# EAGLE design hello.slave (EAGLE 8.6.3)
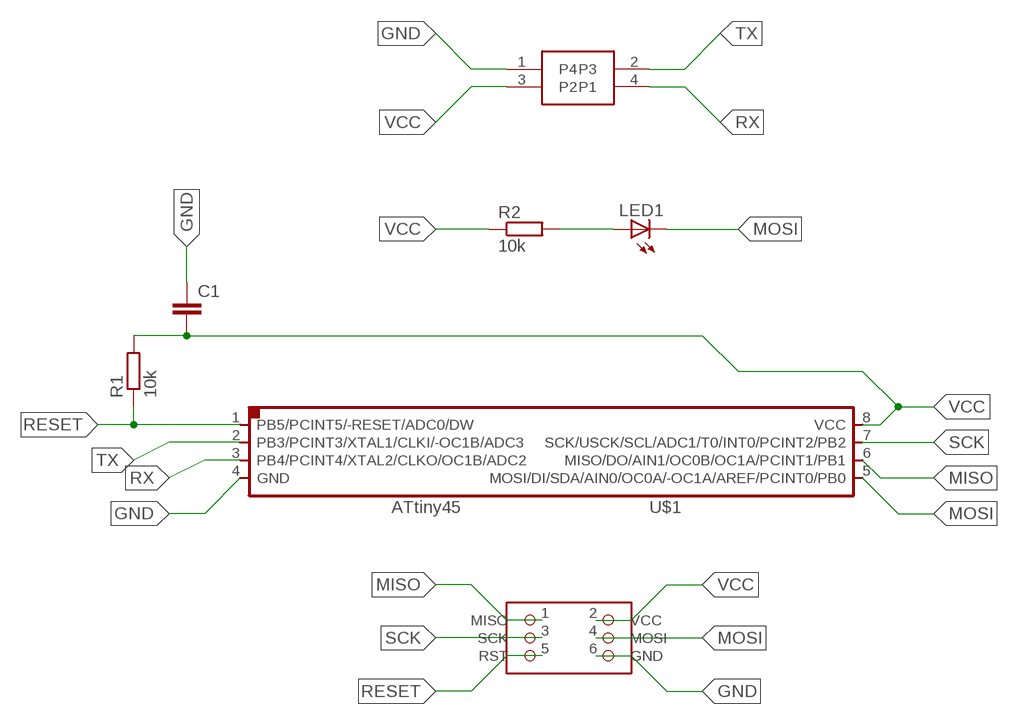
[diagram p0: schematic, sheet 1]

## Parts
C1  C  [C0805]
LED1  LED_E  [LED_1206]
R1  10k  R  [R0805]
R2  10k  R  [R0805]
U$1  ATTINY45SI  [SOIC8]
U$2  AVRISPSMD  [2X03SMD]
U$4  4PIN-SMD-CONNECTOR  [2X02SMD]

## Nets
GND: C1.1 U$1.4(GND) U$2.6(GND) U$4.1(P4)
MISO: U$1.6(MISO/DO/AIN1/OC0B/OC1A/PCINT1/PB1) U$2.1(MISO)
MOSI: LED1.C U$1.5(MOSI/DI/SDA/AIN0/OC0A/-OC1A/AREF/PCINT0/PB0) U$2.4(MOSI)
N$3: LED1.A R2.2
RESET: R1.1 U$1.1(PB5/PCINT5/-RESET/ADC0/DW) U$2.5(RST)
RX: U$1.3(PB4/PCINT4/XTAL2/CLKO/OC1B/ADC2) U$4.4(P1)
SCK: U$1.7(SCK/USCK/SCL/ADC1/T0/INT0/PCINT2/PB2) U$2.3(SCK)
TX: U$1.2(PB3/PCINT3/XTAL1/CLKI/-OC1B/ADC3) U$4.2(P3)
VCC: C1.2 R1.2 R2.1 U$1.8(VCC) U$2.2(VCC) U$4.3(P2)

## Library data of the parts
C1 = eagle-ltspice:C: CAPACITOR, European symbol; SPICEMODEL: NONE; SPICEPREFIX: C
LED1 = eagle-ltspice:LED_E: LED Source: http://www.osram.convergy.de Source: www.luxeon.com Source: www.kingbright.com; SPICEMODEL: NONE; SPICEPREFIX: D; SPICETYPE: diode
R1 R2 = eagle-ltspice:R: RESISTOR, European symbol; SPICEMODEL: NONE; SPICEPREFIX: R
U$1 = fab:ATTINY45
U$2 = fab:AVRISP
U$4 = fab:4PIN-SMD-CONNECTOR

## Board
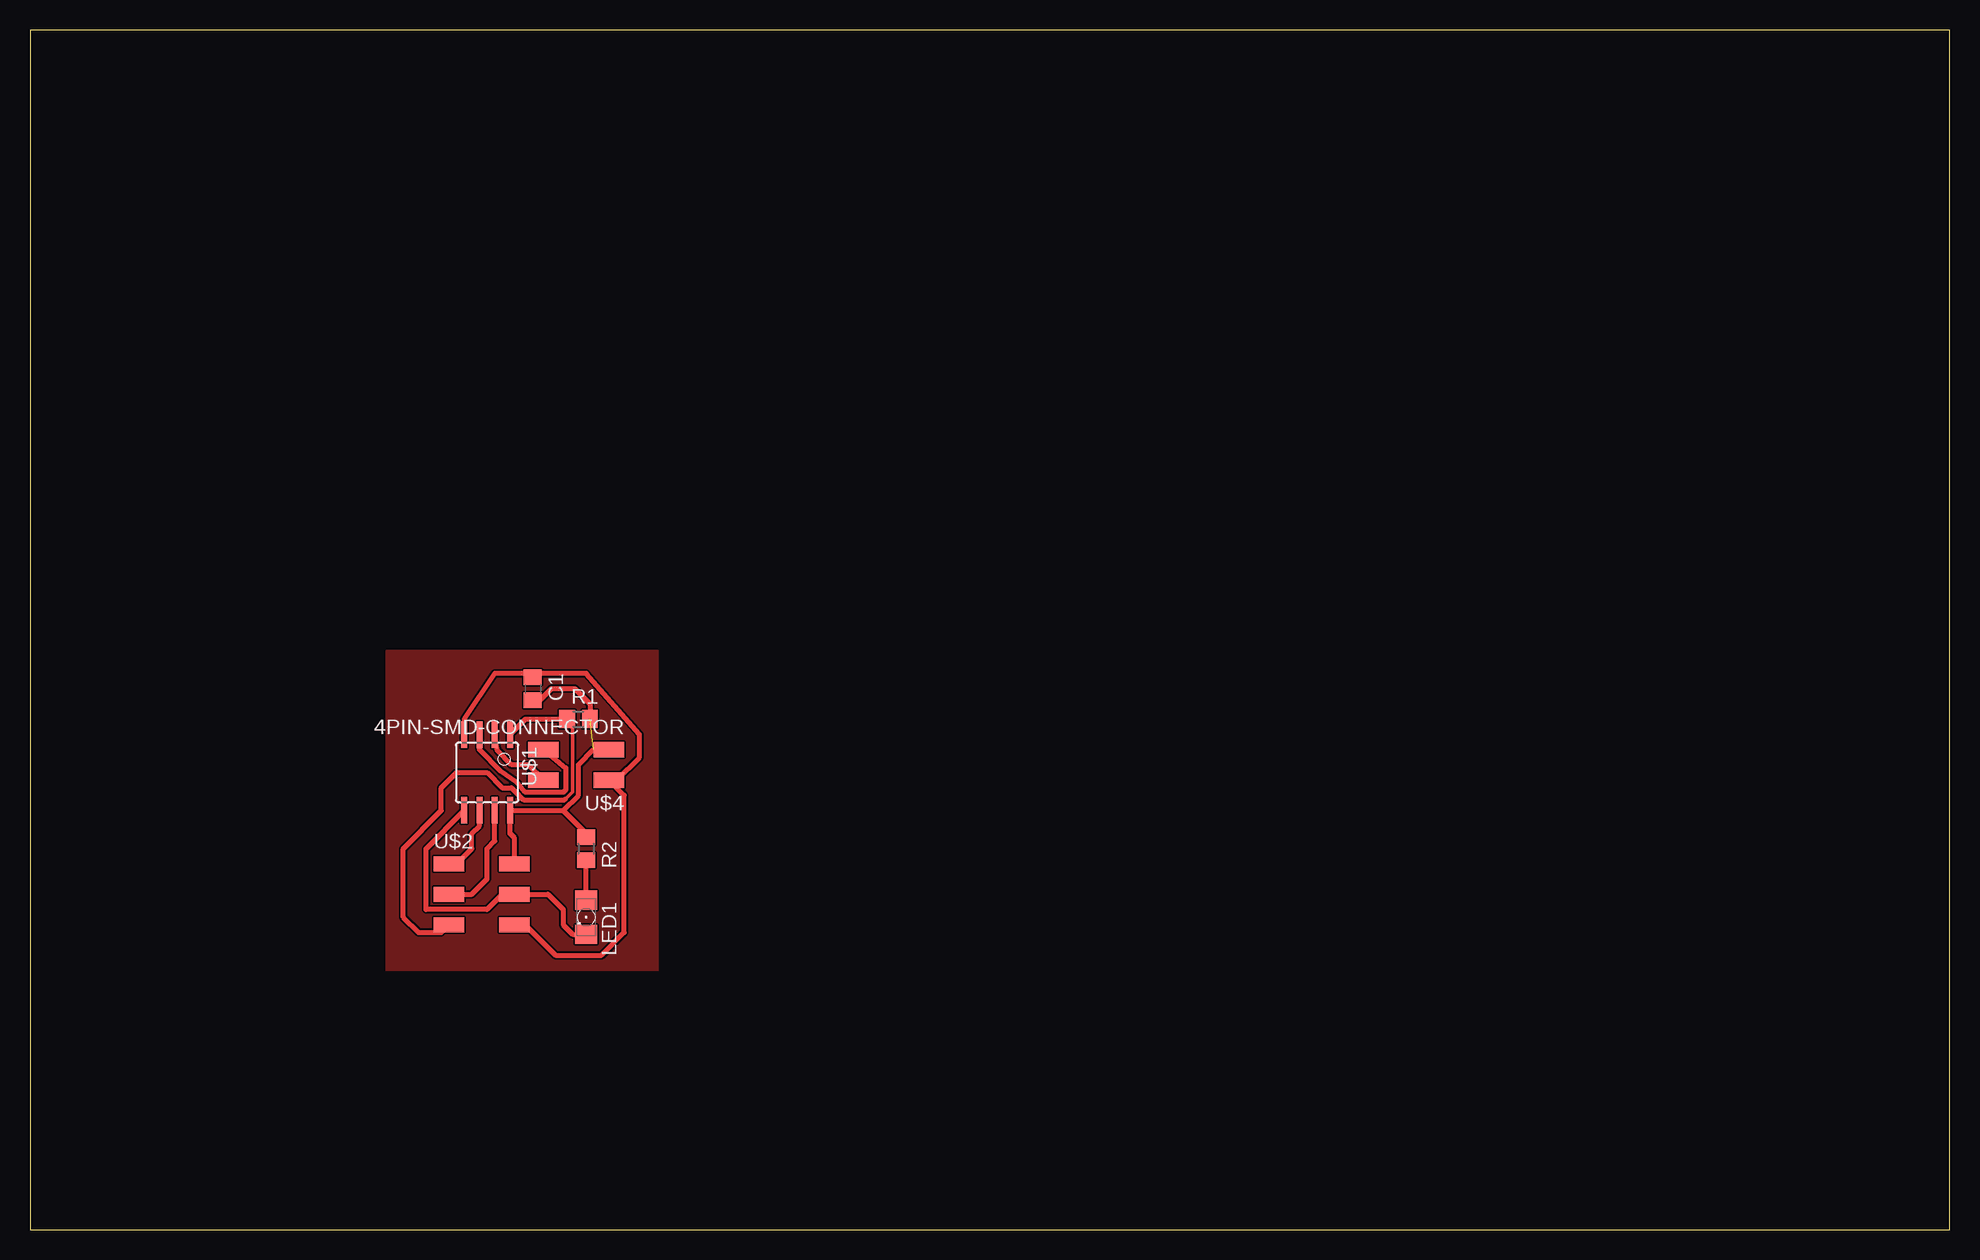
[diagram p1: board, top side]

Size 160 x 100 mm. Coordinates in mm from the lower left corner, seen from the top.
Outline: 0,0 160,0 160,100 0,100 0,0
Copper layers (1*16): Top 0.035mm / dielectric 1.5mm / Bottom 0.035mm
Design rules "default": minimum track width 6mil, minimum drill 0.35mm, track to track 6mil, track to pad 6mil, pad to pad 6mil, via to via 6mil, smd to smd 6mil, copper to edge 40mil, drill to drill 6mil, minimum pad ring 10mil, minimum via ring 8mil, stop-mask expansion 4mil, vias tented up to drill 0mil, thermal gap 10mil

### Footprints (pad centres in the part's own frame; a part is rotated, then mirrored left to right if it is on the bottom)
C0805 = smd 1.3 x 1.5: 1 -0.95,0; 2 0.95,0
LED_1206 = smd 1.6 x 1.803: A -1.422,0; C 1.422,0
R0805 = smd 1.3 x 1.5: 1 -0.95,0; 2 0.95,0
SOIC8 = smd 0.5 x 2.2: 1 -1.905,-3.154; 2 -0.645,-3.154; 3 0.625,-3.154; 4 1.895,-3.154; 5 1.905,3.154; 6 0.635,3.154; 7 -0.635,3.154; 8 -1.905,3.154
2X03SMD = smd 2.54 x 1.27: 1 -2.54,2.54; 2 2.92,2.54; 3 -2.54,0; 4 2.92,0; 5 -2.54,-2.54; 6 2.92,-2.54
2X02SMD = smd 2.54 x 1.27: 1 -2.54,1.27; 2 2.92,1.27; 3 -2.54,-1.27; 4 2.92,-1.27

### Placement (x,y rotation side)
C1  41.91,45.09 270 top
LED1  46.35,26.04 270 top
R1  45.72,42.55 0 top
R2  46.35,31.75 270 top
U$1  38.1,38.1 180 top
U$2  37.47,27.94 0 top
U$4  45.72,38.73 180 top

### Tracks (layer width: path | path; a pad name or v marks a point on that pad's centre or on a via)
GND
  Top 0.406: U$1.4 36.19,41.27 36.2,41.27 36.2,42.55 38.73,46.35 41.27,46.35 | U$2.6 41.27,25.4 43.81,22.86 47.62,22.86 49.53,24.77 49.53,36.2 U$4.1 48.9,37.47 50.8,39.37 50.8,41.27 46.35,46.35 41.27,46.35 | C1.1 41.27,46.35
MISO
  Top 0.406: U$2.1 35.56,30.48 36.83,31.75 36.83,33.02 37.47,33.66 U$1.6
MOSI
  Top 0.406: U$1.5 36.2,34.92 33.02,31.75 33.02,26.67 38.1,26.67 39.37,27.94 U$2.4 43.18,27.94 44.45,26.67 44.45,25.4 45.24,24.61 LED1.C
N$1
  pour Top: 29.72,48.26 52.32,48.26 52.32,21.59 29.72,21.59
N$3
  Top 0.406: LED1.A R2.2
RESET
  Top 0.305: 44.55,35.81 45.21,36.48 45.21,41.78 44.45,42.55
  Top 0.406: U$2.5 34.29,24.77 32.38,24.77 31.11,26.04 31.11,31.75 34.29,34.92 34.29,36.83 35.56,38.1 38.1,38.1 39.37,36.83 40.13,36.83 40.72,36.25 40.72,36.22 40.86,36.07 40.99,35.91 41.02,35.91 41.04,35.89 41.07,35.89 41.15,35.81 44.55,35.81 44.62,35.89 | U$1.1 41.3,42.55 44.45,42.55 R1.1
RX
  Top 0.406: U$4.4 44.65,38.48 44.65,36.65 44.45,36.45 41.27,36.45 40.64,37.22 40.54,37.32 39.27,38.2 37.47,40.01 37.47,41.24 U$1.3
SCK
  Top 0.406: U$2.3 36.83,27.94 38.1,29.21 38.1,31.75 38.73,32.38 U$1.7
TX
  Top 0.406: U$4.2 41.53,38.73 40.16,38.73 38.97,39.93 38.81,40.56 38.73,40.64 38.74,40.65 U$1.2
VCC  (1 unrouted)
  Top 0.406: U$2.2 40.38,32.64 40.01,33.02 U$1.8 40.03,34.92 44.45,34.92 | 44.45,34.92 46.35,33.02 R2.1 | 44.45,34.92 45.72,36.2 45.72,38.73 46.99,40.01 U$4.3 | C1.2 42.56,44.18 43.47,45.09 45.4,45.09 46.67,43.81 R1.2